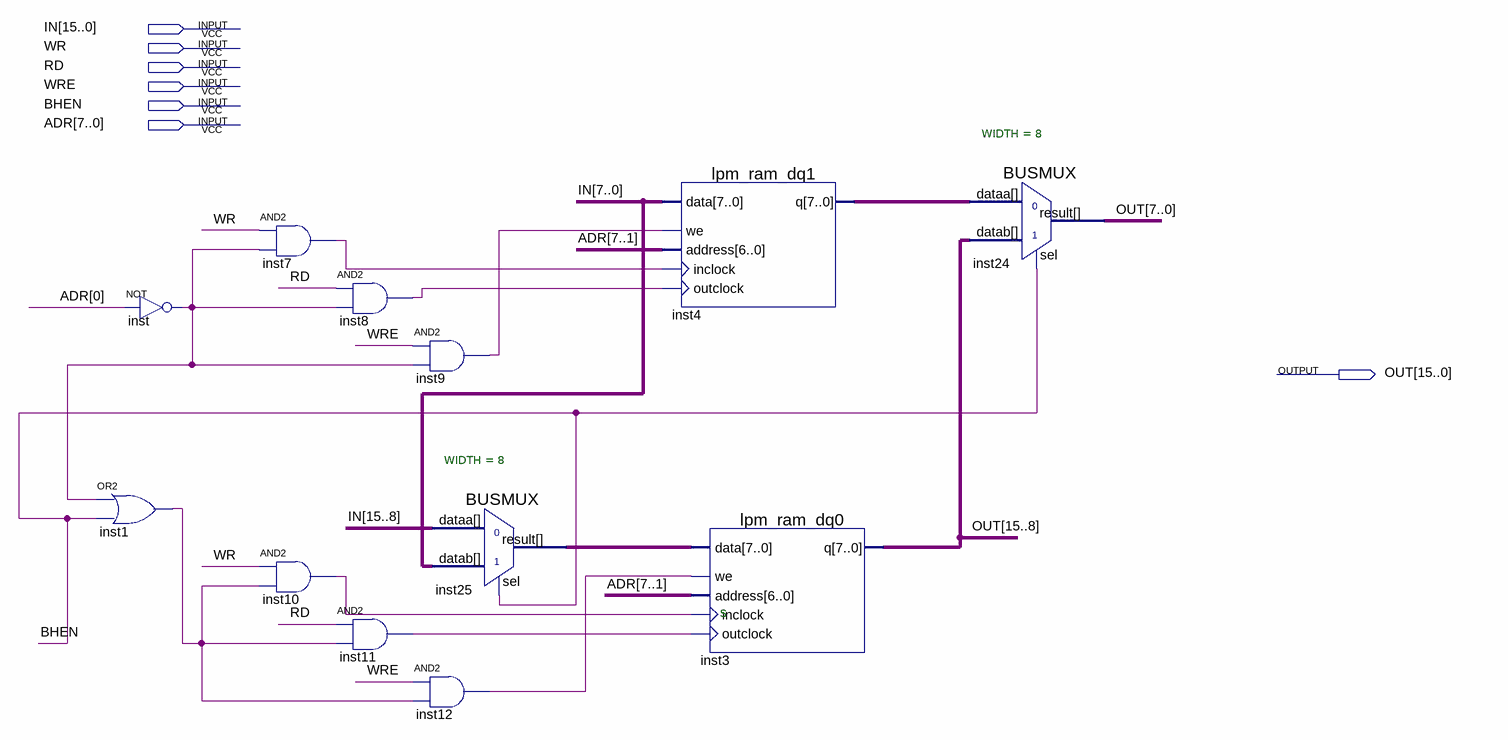
[diagram p0: schematic sheet]
// Quartus schematic MEM_16bitX8adr_eq8bitX8adr.bdf as structural Verilog: 12 symbols, 7 pins
module MEM_16bitX8adr_eq8bitX8adr (
  input  [15:0] IN,
  input  WR,
  input  RD,
  input  WRE,
  input  BHEN,
  input  [7:0] ADR,
  output [15:0] OUT
);

  wire inst1_out, inst7_out, inst8_out, inst9_out, inst10_out, inst11_out, inst12_out, inst_out;
  wire [7:0] inst4_q, inst25_result;

  not inst (inst_out, ADR[0]);
  or inst1 (inst1_out, inst_out, BHEN);
  and inst7 (inst7_out, WR, inst_out);
  and inst10 (inst10_out, WR, inst1_out);
  and inst8 (inst8_out, RD, inst_out);
  and inst11 (inst11_out, RD, inst1_out);
  and inst9 (inst9_out, WRE, inst_out);
  BUSMUX #(.WIDTH(8)) inst25 (.datab(IN[7:0]), .sel(BHEN), .dataa(IN[15:8]), .result(inst25_result));
  and inst12 (inst12_out, WRE, inst1_out);
  lpm_ram_dq1 inst4 (
    .data(IN[7:0]), .we(inst9_out), .address(ADR[7:1]), .inclock(inst7_out), .outclock(inst8_out), .q(inst4_q));
  lpm_ram_dq0 inst3 (
    .data(inst25_result), .we(inst12_out), .address(ADR[7:1]), .inclock(inst10_out), .outclock(inst11_out),
    .q(OUT[15:8]));
  BUSMUX #(.WIDTH(8)) inst24 (.datab(OUT[15:8]), .sel(BHEN), .dataa(inst4_q), .result(OUT[7:0]));

  // Notes on the sheet:
  //   s
endmodule
